# Altium schematic sheet power_supplies.SchDoc
size A
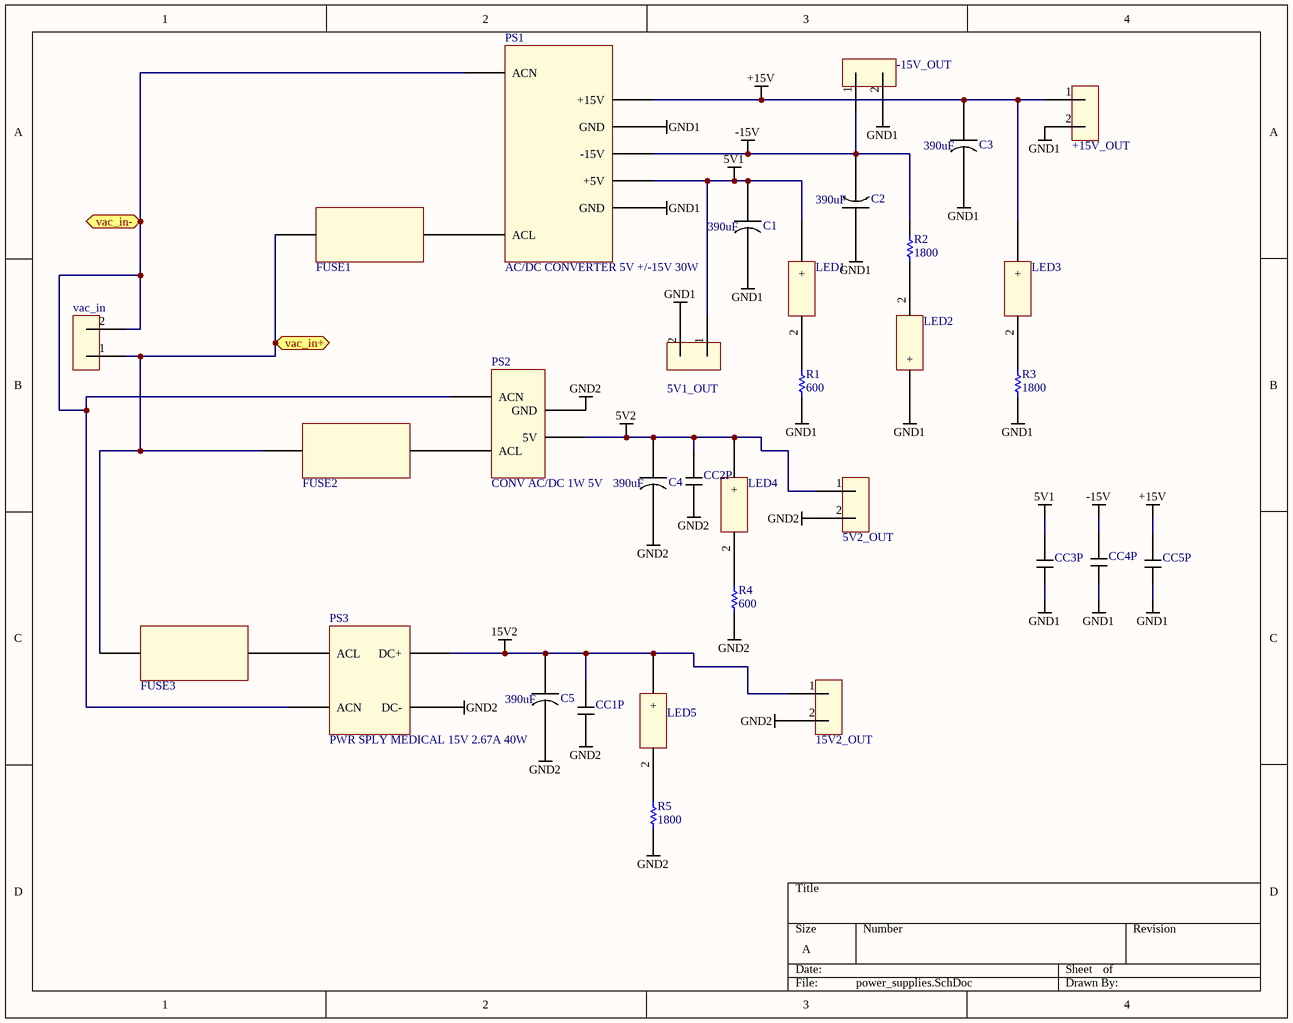
[diagram p0: power_supplies.SchDoc]

## Parts
5V1_OUT  5MM_HOR_ENTRY  [5MM_HOR_ENTRY]  (value not drawn)
5V2_OUT  5MM_HOR_ENTRY  [5MM_HOR_ENTRY]  (value not drawn)
15V2_OUT  5MM_HOR_ENTRY  [5MM_HOR_ENTRY]  (value not drawn)
+15V_OUT  5MM_HOR_ENTRY  [5MM_HOR_ENTRY]  (value not drawn)
-15V_OUT  5MM_HOR_ENTRY  [5MM_HOR_ENTRY]  (value not drawn)
C1  Capacitance: 390uF  [Cap_Pol_5mm]  (hidden comment: C1)
C2  Capacitance: 390uF  [Cap_Pol_5mm]  (hidden comment: C1)
C3  Capacitance: 390uF  [Cap_Pol_5mm]  (hidden comment: C1)
C4  Capacitance: 390uF  [Cap_Pol_5mm]  (hidden comment: C1)
C5  Capacitance: 390uF  [Cap_Pol_5mm]  (hidden comment: C1)
CC1P  CAP_CERAM_5MM  [CAP_CERAM_5MM]  (value not drawn)
CC2P  CAP_CERAM_5MM  [CAP_CERAM_5MM]  (value not drawn)
CC3P  CAP_CERAM_5MM  [CAP_CERAM_5MM]  (value not drawn)
CC4P  CAP_CERAM_5MM  [CAP_CERAM_5MM]  (value not drawn)
CC5P  CAP_CERAM_5MM  [CAP_CERAM_5MM]  (value not drawn)
FUSE1  fuse < 5A  [Fuse < 5A]  (value not drawn)
FUSE2  fuse < 5A  [Fuse < 5A]  (value not drawn)
FUSE3  fuse < 5A  [Fuse < 5A]  (value not drawn)
LED1  LED  [LED]  (value not drawn)
LED2  LED  [LED]  (value not drawn)
LED3  LED  [LED]  (value not drawn)
LED4  LED  [LED]  (value not drawn)
LED5  LED  [LED]  (value not drawn)
PS1  AC/DC CONVERTER 5V +/-15V 30W  [AC/DC CONVERTER 5V +/-15V 30W]
PS2  CONV AC/DC 1W 5V  [CONV AC/DC 1W 5V]
PS3  PWR SPLY MEDICAL 15V 2.67A 40W  [PWR SPLY MEDICAL 15V 2.67A 40W]
R1  value 600  [AXIAL-0.3]  (hidden comment: Res1)
R2  value 1800  [AXIAL-0.3]  (hidden comment: Res1)
R3  value 1800  [AXIAL-0.3]  (hidden comment: Res1)
R4  value 600  [AXIAL-0.3]  (hidden comment: Res1)
R5  value 1800  [AXIAL-0.3]  (hidden comment: Res1)
vac_in  5MM_HOR_ENTRY  [5MM_HOR_ENTRY]  (value not drawn)

## Ports
vac_in+ (bidir), vac_in- (bidir)

## Nets
5V1: 5V1_OUT.1 C1.1 CC3P.1 LED1.1(+) PS1.2(+5V)
5V2: 5V2_OUT.1 C4.1 CC2P.1 LED4.1(+) PS2.4(5V)
15V2: 15V2_OUT.1 C5.1 CC1P.1 LED5.1(+) PS3.3(DC+)
+15V: +15V_OUT.1 C3.1 CC5P.1 LED3.1(+) PS1.5(+15V)
-15V: -15V_OUT.1 C2.2 CC4P.1 PS1.3(-15V) R2.1
GND1: 5V1_OUT.2 +15V_OUT.2 -15V_OUT.2 C1.2 C2.1 C3.2 CC3P.2 CC4P.2 CC5P.2 LED2.1(+) PS1.1(GND) PS1.4(GND) R1.1 R3.1
GND2: 5V2_OUT.2 15V2_OUT.2 C4.2 C5.2 CC1P.2 CC2P.2 PS2.3(GND) PS3.5(DC-) R4.1 R5.2
vac_in+: FUSE1.1 FUSE2.1 FUSE3.1 vac_in.1 ; port vac_in+
vac_in-: PS1.ACN PS2.1(ACN) PS3.2(ACN) vac_in.2 ; port vac_in-
NetFUSE1_2: FUSE1.2 PS1.ACL
NetFUSE2_2: FUSE2.2 PS2.2(ACL)
NetFUSE3_2: FUSE3.2 PS3.1(ACL)
NetLED1_2: LED1.2(-) R1.2
NetLED2_2: LED2.2(-) R2.2
NetLED3_2: LED3.2(-) R3.2
NetLED4_2: LED4.2(-) R4.2
NetLED5_2: LED5.2(-) R5.1

## Library data of the parts
C1-C5 = Cap_Pol_5
R1-R5 = Res1: Resistor; Published: 8-Jun-2000; LatestRevisionDate: 17-Jul-2002; LatestRevisionNote: Re-released for DXP Platform.; PackageReference: AXIAL-0.3; Publisher: Altium Limited; PackageDescription: Axial Device, Thru-Hole; 2 Leads; 0.3 in Pin Spacing